# EAGLE design LitBit (EAGLE 9.0.1)
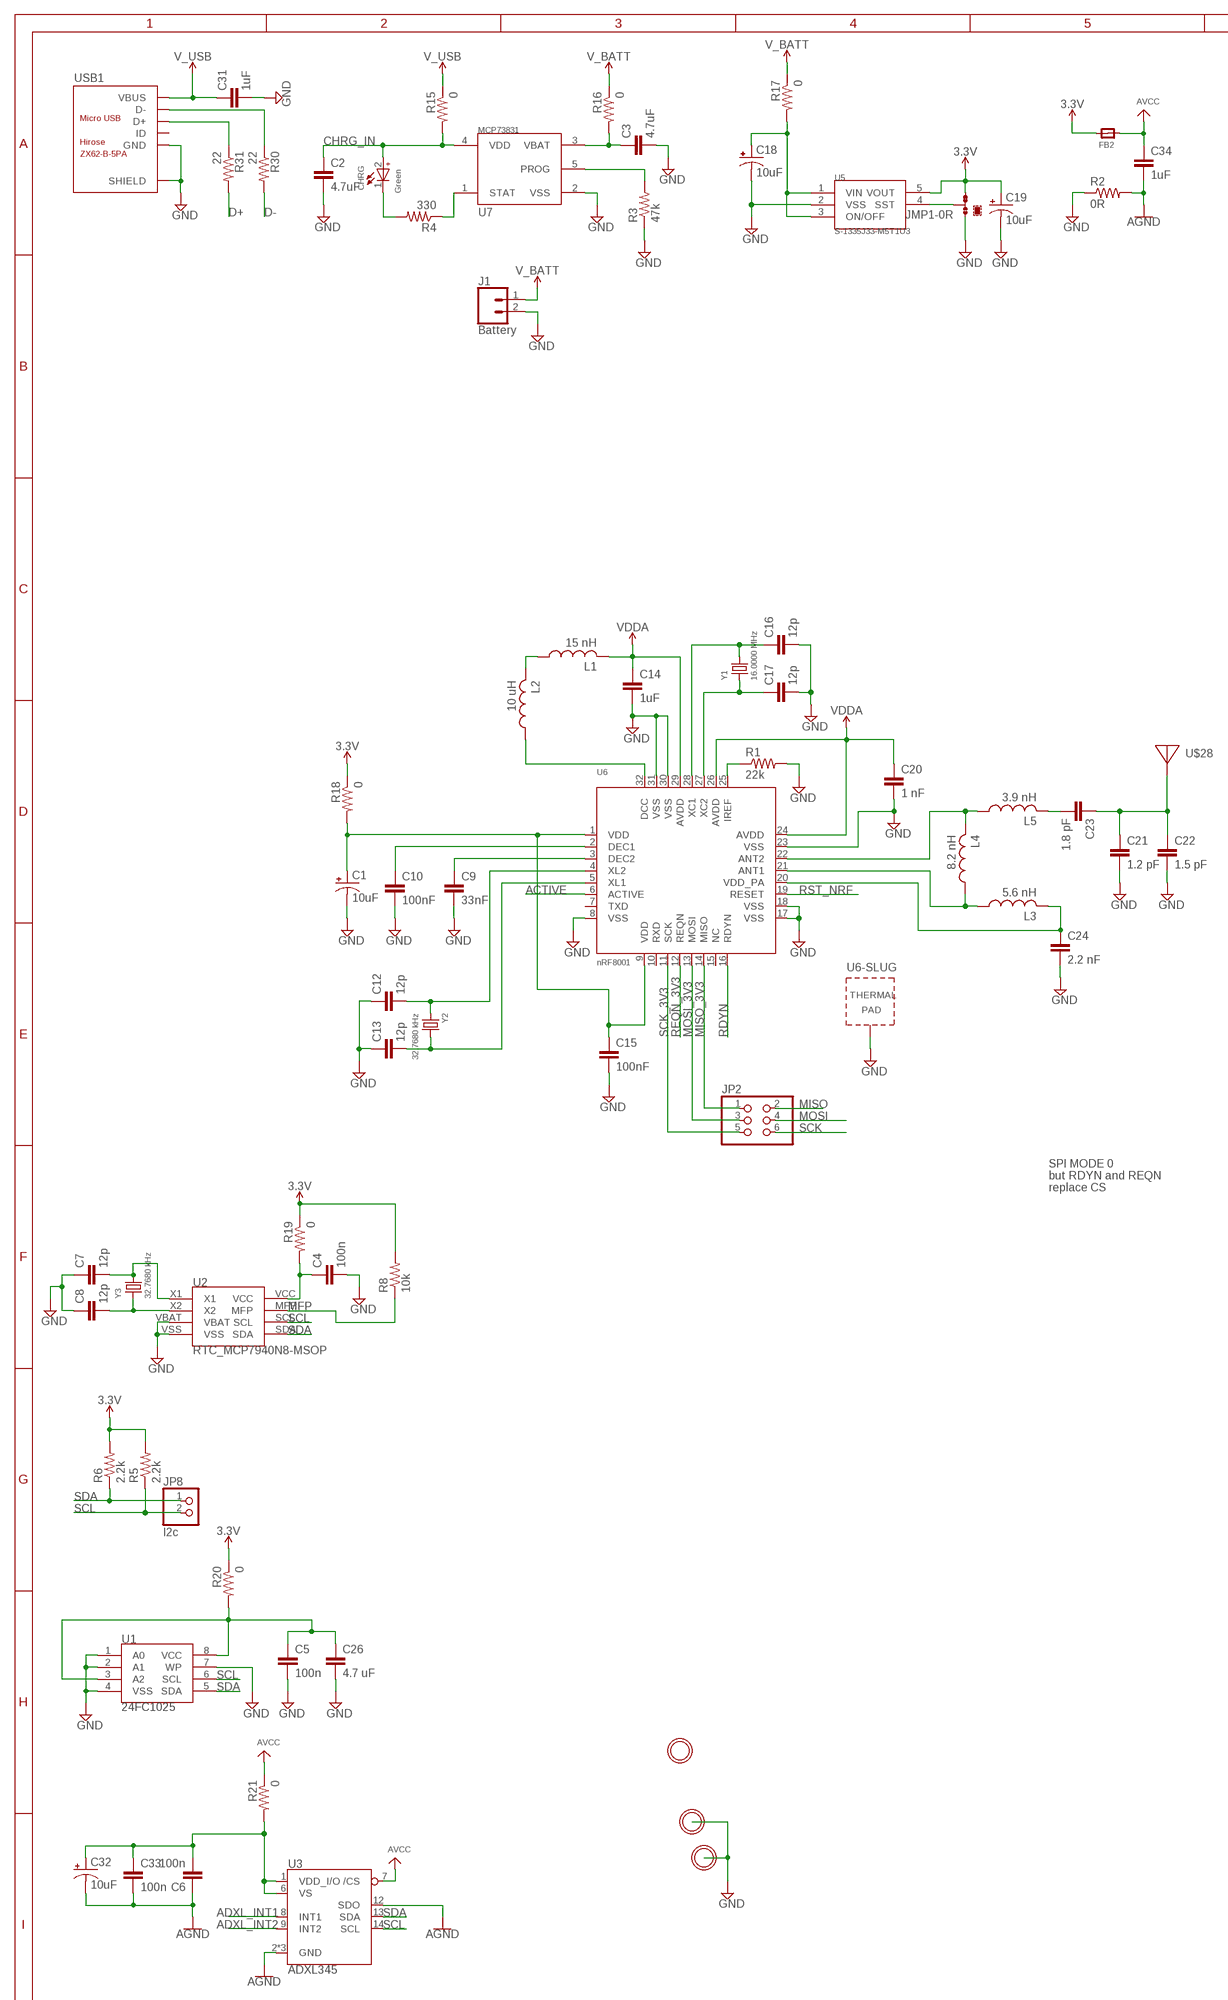
[diagram p0: schematic, sheet 1, part 1 of 2]
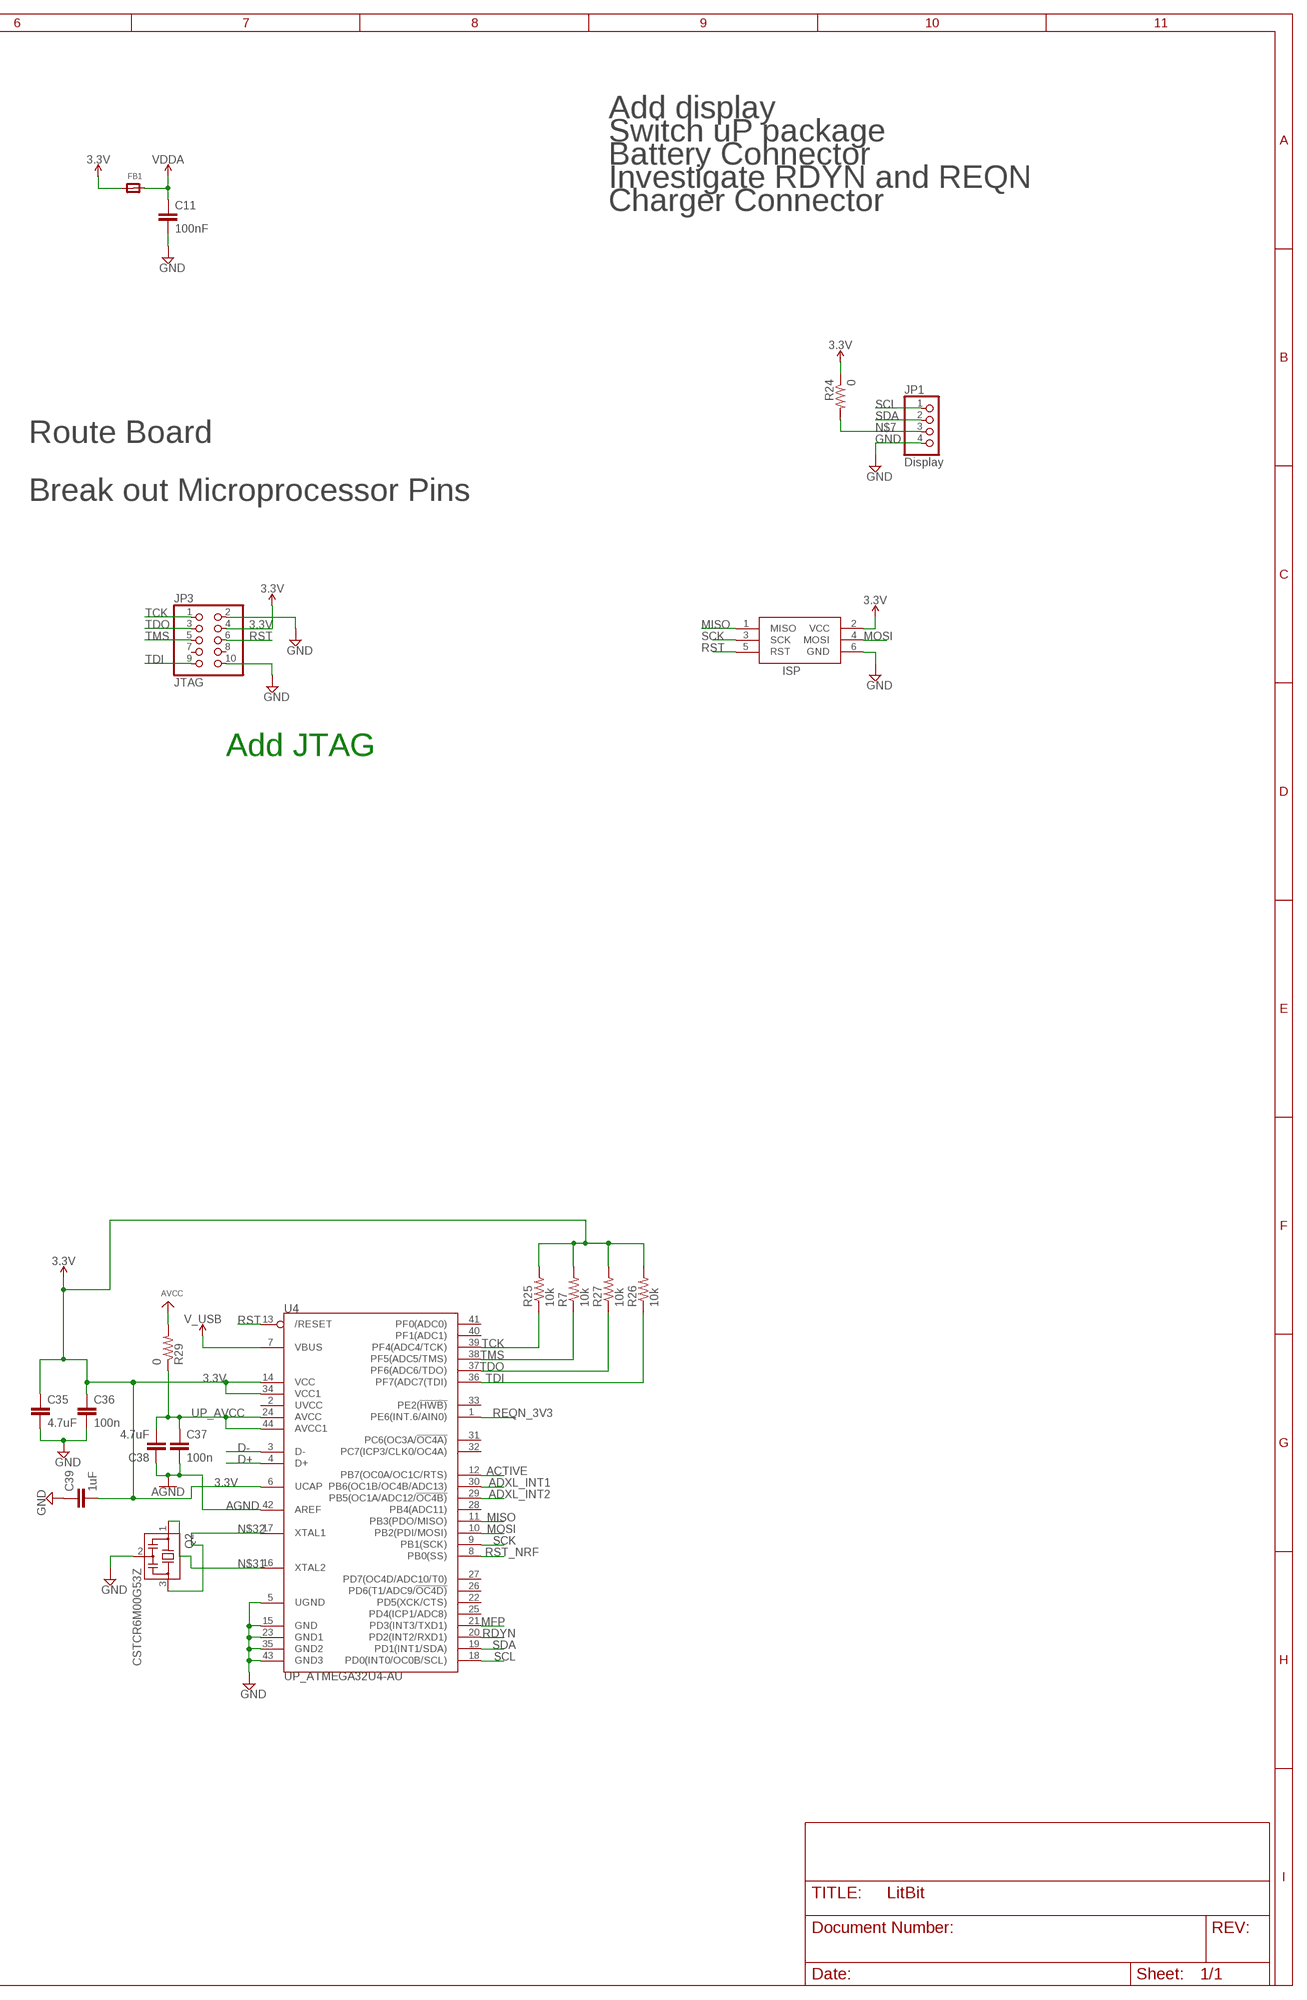
[diagram p1: schematic, sheet 1, part 2 of 2]

## Parts
C1  10uF  CAP_POL_0603  [0603-POLAR]
C2  4.7uF  CAP_NONPOL_0603  [0603-CUSTOM]
C3  4.7uF  CAP_NONPOL_0603  [0603-CUSTOM]
C4  100n  CAP_NONPOL_0603  [0603-CUSTOM]
C5  100n  CAP_NONPOL_0603  [0603-CUSTOM]
C6  100n  CAP_NONPOL_0603  [0603-CUSTOM]
C7  12p  CAP_NONPOL_0603  [0603-CUSTOM]
C8  12p  CAP_NONPOL_0603  [0603-CUSTOM]
C9  33nF  CAP_NONPOL_0603  [0603-CUSTOM]
C10  100nF  CAP_NONPOL_0603  [0603-CUSTOM]
C11  100nF  CAP_NONPOL_0603  [0603-CUSTOM]
C12  12p  CAP_NONPOL_0603  [0603-CUSTOM]
C13  12p  CAP_NONPOL_0603  [0603-CUSTOM]
C14  1uF  CAP_NONPOL_0603  [0603-CUSTOM]
C15  100nF  CAP_NONPOL_0603  [0603-CUSTOM]
C16  12p  CAP_NONPOL_0603  [0603-CUSTOM]
C17  12p  CAP_NONPOL_0603  [0603-CUSTOM]
C18  10uF  CAP_POL_0603  [0603-POLAR]
C19  10uF  CAP_POL_0603  [0603-POLAR]
C20  1 nF  CAP_NONPOL_0603  [0603-CUSTOM]
C21  1.2 pF  CAP_NONPOL_0603  [0603-CUSTOM]
C22  1.5 pF  CAP_NONPOL_0603  [0603-CUSTOM]
C23  1.8 pF  CAP_NONPOL_0603  [0603-CUSTOM]
C24  2.2 nF  CAP_NONPOL_0603  [0603-CUSTOM]
C26  4.7 uF  CAP_NONPOL_0603  [0603-CUSTOM]
C31  1uF  CAP_NONPOL_0603  [0603-CUSTOM]
C32  10uF  CAP_POL_0603  [0603-POLAR]
C33  100n  CAP_NONPOL_0603  [0603-CUSTOM]
C34  1uF  CAP_NONPOL_0603  [0603-CUSTOM]
C35  4.7uF  CAP_NONPOL_0603  [0603-CUSTOM]
C36  100n  CAP_NONPOL_0603  [0603-CUSTOM]
C37  100n  CAP_NONPOL_0603  [0603-CUSTOM]
C38  4.7uF  CAP_NONPOL_0603  [0603-CUSTOM]
C39  1uF  CAP_NONPOL_0603  [0603-CUSTOM]
CHRG  Green  LED_WL-SMCW-150060GS75000  [0603-LED]
FB1  FERRITE  [0603-CUSTOM]
FB2  FERRITE  [0603-CUSTOM]
GND  MOUNTINGHOLE2.0  [MOUNTINGHOLE_2.0_PLATED]
ISP  AVRISP-6  [AVRISP]
J1  Battery  CONN_02-JST-2MM-SMT  [JST-2-SMD]
JMP1  0R-JUMPA  [AOR-JMP-0603]
JP1  Display  PINHD-1X4  [1X04]
JP2  PINHD-2X3  [2X03]
JP3  JTAG  PINHD-2X5  [2X05]
JP8  I2c  PINHD-1X2  [1X02]
L1  15 nH  IND-0603  [0603-CUSTOM]
L2  10 uH  IND-0805  [0805-CUSTOM]
L3  5.6 nH  IND-0603  [0603-CUSTOM]
L4  8.2 nH  IND-0603  [0603-CUSTOM]
L5  3.9 nH  IND-0603  [0603-CUSTOM]
Q2  CSTCR6M00G53Z  [CSTCR6M]
R1  22k  RES-0603  [0603-CUSTOM]
R2  0R  RES-0603  [0603-CUSTOM]
R3  47k  RES-0603  [0603-CUSTOM]
R4  330  RES-0603  [0603-CUSTOM]
R5  2.2k  RES-0603  [0603-CUSTOM]
R6  2.2k  RES-0603  [0603-CUSTOM]
R7  10k  RES-0603  [0603-CUSTOM]
R8  10k  RES-0603  [0603-CUSTOM]
R15  0  RES-0603  [0603-CUSTOM]
R16  0  RES-0603  [0603-CUSTOM]
R17  0  RES-0603  [0603-CUSTOM]
R18  0  RES-0603  [0603-CUSTOM]
R19  0  RES-0603  [0603-CUSTOM]
R20  0  RES-0603  [0603-CUSTOM]
R21  0  RES-0603  [0603-CUSTOM]
R24  0  RES-0603  [0603-CUSTOM]
R25  10k  RES-0603  [0603-CUSTOM]
R26  10k  RES-0603  [0603-CUSTOM]
R27  10k  RES-0603  [0603-CUSTOM]
R29  0  RES-0603  [0603-CUSTOM]
R30  22  RES-0603  [0603-CUSTOM]
R31  22  RES-0603  [0603-CUSTOM]
U1  24FC1025  [8-SOIC_HAND_SOLDER]
U2  RTC_MCP7940N8-MSOP  [8-MSOP-CUSTOM]
U3  ADXL345  [LGA-14]
U4  UP_ATMEGA32U4-AU  [TQFP44]
U5  S-1335J33-M5T1U3  [SOT23-5_HAND_SOLDER]
U6  nRF8001  NRF8001  [QFN32_5MM]
U7  MCP73831  [SOT23-5_HAND_SOLDER]
U$8  MOUNTINGHOLE2.0  [MOUNTINGHOLE_2.0_PLATED]
U$13  MOUNTINGHOLE2.0  [MOUNTINGHOLE_2.0_PLATED]
U$28  ANTENNA_PCBNRF8001_1.6MM  [ANT_PCB_2.4GHZ_NRF8001_1.6MM_1OZ]
USB1  ZX62-B-5PA  MICRO-USB-SMD(ZX62-B-5PA)  [MICRO-USB5+6P-SMD-0.65-AB]
Y1  16.0000 MHz  FA-238_CRYSTAL  [4-SMD]
Y2  32.7680 kHz  CRYSTAL_ABS07  [2-SMD]
Y3  32.7680 kHz  CRYSTAL_ABS07  [2-SMD]

## Nets
3.3V: C19.1(+) C35.1 C36.1 C39.2 FB1.1 FB2.2 ISP.2(VCC) JMP1.3 JP3.4 R5.2 R6.2 R7.2 R8.2 R18.1 R19.1 R20.1 R24.1 R25.2 R26.2 R27.2 U4.6(UCAP) U4.14(VCC) U4.34(VCC1) U5.5(VOUT)
ACTIVE: U4.12(PB7(OC0A/OC1C/RTS)) U6.6(ACTIVE)
ADXL_INT1: U3.8(INT1) U4.30(PB6(OC1B/OC4B/ADC13))
ADXL_INT2: U3.9(INT2) U4.29(PB5(OC1A/ADC12/!OC4B))
AGND: C6.1 C32.2(-) C33.2 C34.2 C37.2 C38.1 R2.2 U3.2(GND) U3.4(GND) U3.5(GND) U3.12(SDO) U4.42(AREF)
AVCC: C34.1 FB2.1 R21.1 R29.2 U3.7(/CS)
CHRG_IN: C2.1 CHRG.2(+) R15.2 U7.4(VDD)
D+: R31.2 U4.4(D+)
D-: R30.2 U4.3(D-)
GND: C1.2(-) C2.2 C3.2 C4.2 C5.2 C7.1 C8.1 C9.2 C10.2 C11.2 C12.1 C13.1 C14.2 C15.2 C16.2 C17.2 C18.2(-) C19.2(-) C20.2 C21.2 C22.2 C24.2 C26.2 C31.2 C35.2 C36.2 C39.1 ISP.6(GND) J1.2 JMP1.1 JP1.4 JP3.2 JP3.10 Q2.2 R1.2 R2.1 R3.1 U1.1(A0) U1.2(A1) U1.4(VSS) U1.7(WP) U2.VBAT U2.VSS U4.5(UGND) U4.15(GND) U4.23(GND1) U4.35(GND2) U4.43(GND3) U5.2(VSS) U6.8(VSS) U6.17(VSS) U6.18(VSS) U6.23(VSS) U6.30(VSS) U6.31(VSS) U6.33(TP) U7.2(VSS) USB1.5(GND) USB1.P1(SHIELD) USB1.P2(SHIELD) USB1.P3(SHIELD) USB1.P4(SHIELD) USB1.P5(SHIELD) USB1.P6(SHIELD)
MFP: R8.1 U2.MFP U4.21(PD3(INT3/TXD1))
MISO: ISP.1(MISO) JP2.2 U4.11(PB3(PDO/MISO))
MISO_3V3: JP2.1 U6.14(MISO)
MOSI: ISP.4(MOSI) JP2.4 U4.10(PB2(PDI/MOSI))
MOSI_3V3: JP2.3 U6.13(MOSI)
N$1: C7.2 U2.X1 Y3.P$2
N$2: C8.2 U2.X2 Y3.P$1
N$3: C10.1 U6.2(DEC1)
N$4: C9.1 U6.3(DEC2)
N$5: C12.2 U6.4(XL2) Y2.P$1
N$6: C13.2 U6.5(XL1) Y2.P$2
N$7 [PWR]: JP1.3 R24.2
N$8: C1.1(+) C15.1 R18.2 U6.1(VDD) U6.9(VDD)
N$9: R30.1 USB1.2(D-)
N$10: L1.1 L2.2
N$11: L2.1 U6.32(DCC)
N$12: C16.1 U6.28(XC1) Y1.P3
N$13: JMP1.2 U5.4(SST)
N$14: C18.1(+) R17.2 U5.1(VIN) U5.3(ON/OFF)
N$16 [PWR]: C3.1 R16.2 U7.3(VBAT)
N$17: C5.1 C26.1 R20.2 U1.3(A2) U1.8(VCC)
N$18: C17.1 U6.27(XC2) Y1.P1
N$19: C23.2 L5.2
N$20: L4.2 L5.1 U6.22(ANT2)
N$21: L3.1 L4.1 U6.21(ANT1)
N$22: R1.1 U6.25(IREF)
N$23: C24.1 L3.2 U6.20(VDD_PA)
N$24: C21.1 C22.1 C23.1 U$28.FEED
N$25: CHRG.1(-) R4.2
N$26: R3.2 U7.5(PROG)
N$27: R4.1 U7.1(STAT)
N$28: R31.1 USB1.3(D+)
N$29: C4.1 R19.2 U2.VCC
N$31: Q2.1 U4.16(XTAL2)
N$32: Q2.3 U4.17(XTAL1)
N$36: C6.2 C32.1(+) C33.1 R21.2 U3.1(VDD_I/O) U3.6(VS)
RDYN: U4.20(PD2(INT2/RXD1)) U6.16(RDYN)
REQN_3V3: U4.1(PE6(INT.6/AIN0)) U6.12(REQN)
RST: ISP.5(RST) JP3.6 U4.13(/RESET)
RST_NRF: U4.8(PB0(SS)) U6.19(RESET)
SCK: ISP.3(SCK) JP2.6 U4.9(PB1(SCK))
SCK_3V3: JP2.5 U6.11(SCK)
SCL: JP1.1 JP8.2 R5.1 U1.6(SCL) U2.SCL U3.14(SCL) U4.18(PD0(INT0/OC0B/SCL))
SDA: JP1.2 JP8.1 R6.1 U1.5(SDA) U2.SDA U3.13(SDA) U4.19(PD1(INT1/SDA))
TCK: JP3.1 R25.1 U4.39(PF4(ADC4/TCK))
TDI: JP3.9 R26.1 U4.36(PF7(ADC7(TDI))
TDO: JP3.3 R27.1 U4.37(PF6(ADC6/TDO))
TMS: JP3.5 R7.1 U4.38(PF5(ADC5/TMS))
UP_AVCC: C37.1 C38.2 R29.1 U4.24(AVCC) U4.44(AVCC1)
V_BATT [PWR]: J1.1 R16.1 R17.1
V_USB: C31.1 R15.1 U4.7(VBUS) USB1.1(VBUS)
VDDA: C11.1 C14.1 C20.1 FB1.2 L1.2 U6.24(AVDD) U6.26(AVDD) U6.29(AVDD)
Unconnected: JP3.7 JP3.8 U4.2(UVCC) U4.22(PD5(XCK/CTS)) U4.25(PD4(ICP1/ADC8)) U4.26(PD6(T1/ADC9/!OC4D)) U4.27(PD7(OC4D/ADC10/T0)) U4.28(PB4(ADC11)) U4.31(PC6(OC3A/!OC4A)) U4.32(PC7(ICP3/CLK0/OC4A)) U4.33(PE2(!HWB)) U4.40(PF1(ADC1)) U4.41(PF0(ADC0)) U6.7(TXD) U6.10(RXD) U6.15(NC) USB1.4(ID)

## Notes on the sheet
- Add display
- Switch uP package
- Battery Connector
- Investigate RDYN and REQN
- Charger Connector
- Route Board
- Break out Microprocessor Pins
- Add JTAG
- SPI MODE 0
- but RDYN and REQN
- replace CS

## Library data of the parts
C1 C18 C19 C32 = SCADA_CUSTOM_LIBRARY:CAP_POL_0603
C2-C17 C20-C24 C26 C31 C33-C39 = SCADA_CUSTOM_LIBRARY:CAP_NONPOL_0603
CHRG = SCADA_CUSTOM_LIBRARY:LED_WL-SMCW: SMD mono-color Chip LED Characteristics Low energy consumption High reliability Low current requirement Fast switching No UV/IR radiation Smallest SMD package with exceptional brightness Top view Wide viewing angle PBC high-usage Applications Backlight for mobile and portable device keypads Indoor and outdoor message boards Flat backlight for LCDs, switches and symbols Display for industrial control systems and traffic Miniaturized color effects Pedestrian mark Optical indicators General lighting Toys <http://katalog.we-online.de/media/images/v2/Family_WL-SMCW.jpg> Details see: http://katalog.we-online.de/en/led/WL-SMCW?m Updated 2015-04-10 2015 (C) Wurth Elektronik
FB1 FB2 = SCADA_CUSTOM_LIBRARY:FERRITE: Ferrite Bead 0603 MMZ1608B121C - 120 Ohm @ 100MHz, 600mA, 0.15 Ohm DC Resistance - Digikey: 445-2164-1-ND BK1608HW121-T - 120 Ohm, 600mA Ferrite Chip - Digikey: 587-1876-2-ND 0805 HZ0805B272R-10 - 2.7K Ohm @ 100MHz, 200mA, 0.8 Ohm DC Resistance - Digikey: 240-2504-1-ND (see also Murata BLM21BD272SN1L) MMZ2012Y152B - 1.5K Ohm @ 100MHz, 500mA, 0.4 Ohm DC Resistance - Digikey: 445-1560-1-ND - Mainly for high frequency (80-400MHz) MMZ2012R102A - 1K Ohm @ 100MHz, 500mA, 0.3 Ohm DC Resistance - Digikey: 445-1555-2-ND - More general purpose (10-200MHz)
GND U$8 U$13 = microbuilder:MOUNTINGHOLE: Mounting Hole For #2 screws (0.086"/2.18mm width, 0.094"/2.4mm hole) use 2.5mm
ISP = adafruit:AVRISP: AVR ISP HEADER Standard 6 pin header for AVR programming
J1 = SparkFun-Connectors:CONN_02: Multi connection point. Often used as Generic Header-pin footprint for 0.1 inch spaced/style header connections On any of the 0.1 inch spaced packages, you can populate with these: Break Away Headers - Straight <https://www.sparkfun.com/products/116> (PRT-00116) Break Away Male Headers - Right Angle <https://www.sparkfun.com/products/553> (PRT-00553) Female Headers <https://www.sparkfun.com/products/115> (PRT-00115) Break Away Headers - Machine Pin <https://www.sparkfun.com/products/117> (PRT-00117) Break Away Female Headers - Swiss Machine Pin <https://www.sparkfun.com/products/743> (PRT-00743) For SCREWTERMINALS and SPRING TERMINALS visit here: Screw Terimnals on SparkFun.com <https://www.sparkfun.com/search/results?term=Screw+Terminals> (5mm/3.5mm/2.54mm spacing) This device is also useful as a general connection point to wire up your design to another part of your project. Our various solder wires solder well into these plated through hole pads. Hook-Up Wire - Assortment (Stranded, 22 AWG) <https://www.sparkfun.com/products/11375> (PRT-11375) Hook-Up Wire - Assortment (Solid Core, 22 AWG) <https://www.sparkfun.com/products/11367> (PRT-11367) View the entire wire category on our website here <https://www.sparkfun.com/categories/141> Special notes: Molex polarized connector foot print use with: PRT-08233 with associated crimp pins and housings. 2.54_SCREWTERM for use with PRT-10571. 3.5mm Screw Terminal footprints for PRT-08084 5mm Screw Terminal footprints for use with PRT-08432; PROD_ID: CONN-11443
JMP1 = SCADA_CUSTOM_LIBRARY:0R-JUMP: SMD 0R 0805 Jumper
JP1 = pinhead:PINHD-1X4: PIN HEADER
JP2 = pinhead:PINHD-2X3: PIN HEADER
JP3 = pinhead:PINHD-2X5: PIN HEADER
JP8 = pinhead:PINHD-1X2: PIN HEADER
L1 L3-L5 = SCADA_CUSTOM_LIBRARY:IND-0603
L2 = SCADA_CUSTOM_LIBRARY:IND-0805
Q2 = murata-filter:CSTCR: Resonator Source: murata.co.jp; MPN: CSTCR6M00G53-R0; OC_FARNELL: 1170434; OC_NEWARK: 25M8759
R1-R8 R15-R21 R24-R27 R29-R31 = SCADA_CUSTOM_LIBRARY:RES-0603
U1 = SCADA_CUSTOM_LIBRARY:24FC1025
U2 = SCADA_CUSTOM_LIBRARY:RTC_MCP7940N
U3 = SCADA_CUSTOM_LIBRARY:ADXL345: Analog Devices ADXL345 3-Axis SPI/I2C 2/4/8/16g Accelerometer The ADXL345 is a small, thin, low power, 3-axis accelerometer with high resolution (13-bit) measurement at up to ±16g. Digital output data is formatted as 16-bit twos complement and is accessible through either a SPI (3- or 4-wire) or I2C digital interface. Datasheet <https://www.sparkfun.com/datasheets/Sensors/Accelerometer/ADXL345.pdf> SparkFun Products SparkFun Triple Axis Accelerometer Breakout - ADXL345 <https://www.sparkfun.com/products/9836> (SEN-09836) Triple Axis Accelerometer - ADXL345 <https://www.sparkfun.com/products/9045> (SEN-09045) SparkFun 6 Degrees of Freedom IMU Digital Combo Board - ITG3200/ADXL345 <https://www.sparkfun.com/products/10121> (SEN-10121); PROD_ID: IC-09097; SF_ID: SEN-09045
U4 = SCADA_CUSTOM_LIBRARY:UP_ATMEGA32U4: http://www.ladyada.net/library/eagle
U5 = SCADA_CUSTOM_LIBRARY:S-1335J33-M5T1U3
U6 = microbuilder:NRF8001: nRF8001 - Bluetooth Low-Energy Transceiver VDD: 1.9-3.6V Temp: -40°C - 85°C
U7 = SCADA_CUSTOM_LIBRARY:MCP73831: MCP73831/2 Miniature Single-Cell, Fully Integrated Li-Ion, Li-Polymer Charge Management Controllers. Nice and small simple lipoly charge controller, with adjustable current and status output (LED) http://www.ladyada.net/library/pcb/eaglelibrary.html
U$28 = microbuilder:ANTENNA_PCB: Various pre-calculated PCB Antennas NRF8001 1.6mm 1Oz - 2.4GHz PCB antenna for 1.6mm PCBs with 1oz copper, double-sided boards (no GND plan beneath antenna). See nRF2740 production files for further information and impedance matching network. 868MHz/2.4GHz DUALBAND - Dual 868MHz and 2.4GHz centered antenna based on board #6 of the CC-ANTENNA-DK from Chipcon/TI
USB1 = Seeed-Connector:MICRO-USB-SMD(ZX62-B-5PA): 320010005; MPN: ZX62-B-5PA
Y1 = SCADA_CUSTOM_LIBRARY:FA-238_CRYSTAL
Y2 Y3 = SCADA_CUSTOM_LIBRARY:CRYSTAL_ABS07

## Net classes
0 Default: width 0.203 mm
1 PWR: width 0.508 mm
2 V_BATT: width 0.508 mm

## Board
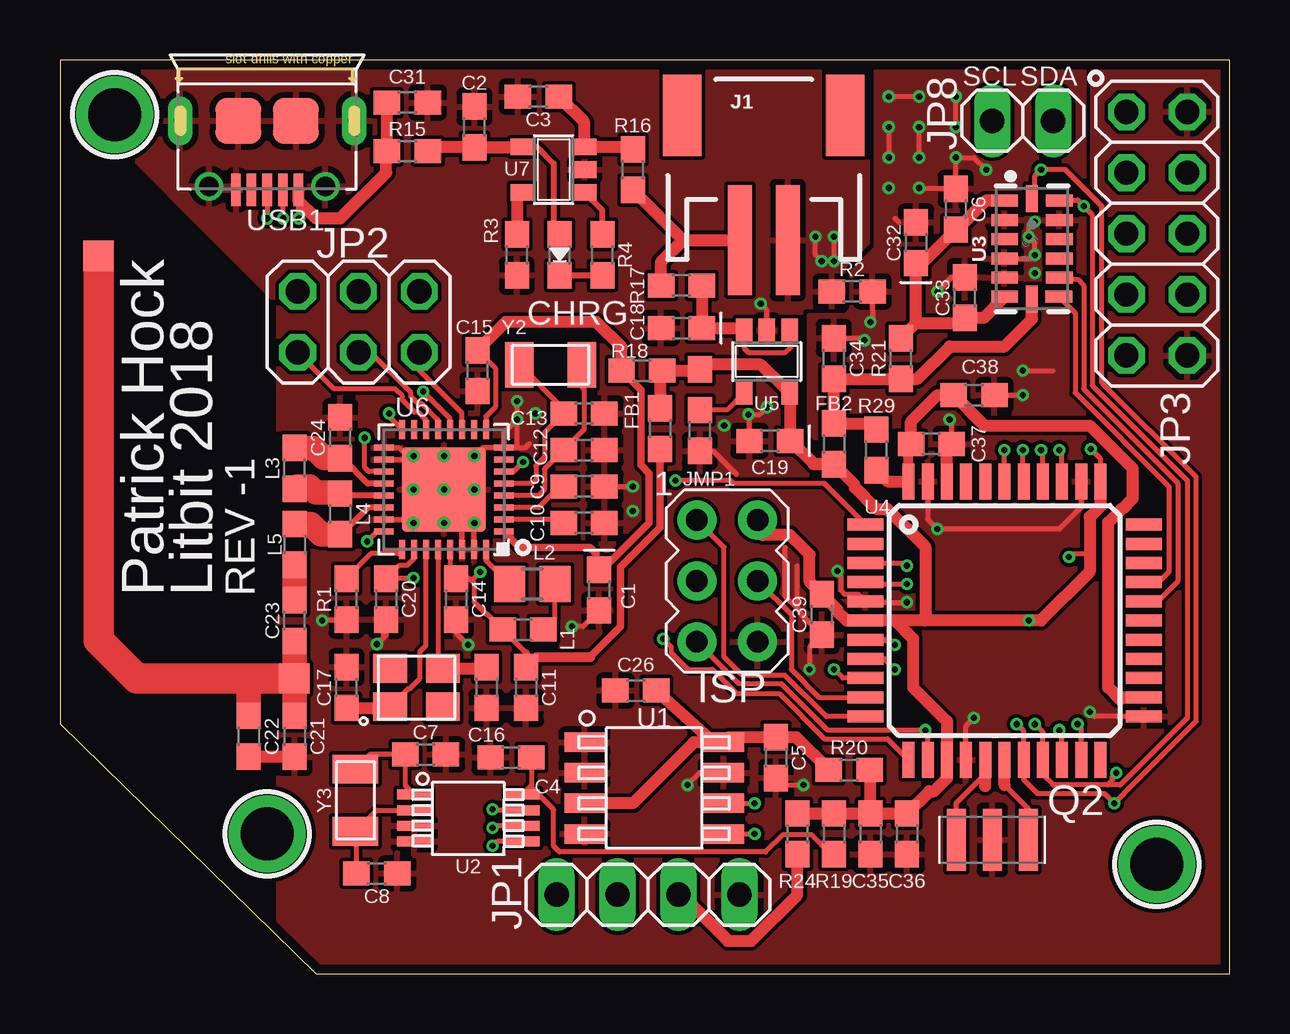
[diagram p2: board, top side]
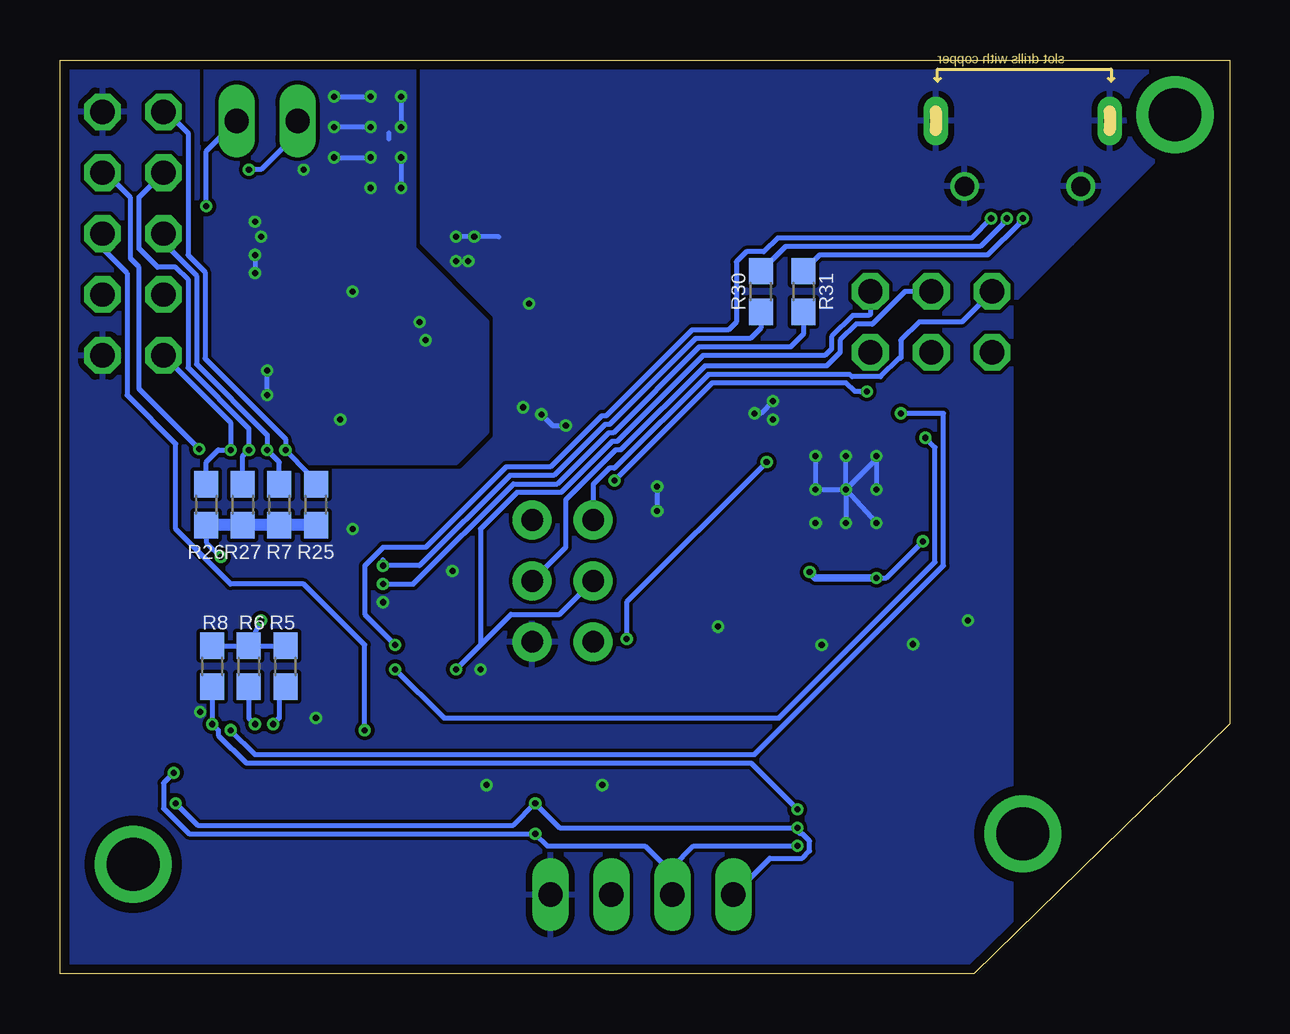
[diagram p3: board, bottom side, seen from below]

Size 48.77 x 38.1 mm. Coordinates in mm from the lower left corner, seen from the top.
Outline: 48.77,0 48.77,38.1 0,38.1 0,10.41 10.67,0 48.77,0
Copper layers (1*16): Top 0.035559375mm / dielectric 1.6mm / Bottom 0.035559375mm
Design rules "oshpark-2layer": minimum track width 6mil, minimum drill 10mil, track to track 6mil, track to pad 6mil, pad to pad 6mil, via to via 6mil, smd to smd 6mil, copper to edge 15mil, drill to drill 6mil, minimum pad ring 5mil, minimum via ring 5mil, stop-mask expansion 2.5mil, vias tented up to drill 0mil, thermal gap 10mil

### Footprints (pad centres in the part's own frame; a part is rotated, then mirrored left to right if it is on the bottom)
0603-POLAR = smd 1.1 x 1: 1 -0.85,0; 2 0.85,0
0603-CUSTOM = smd 1.1 x 1: 1 -0.85,0; 2 0.85,0
0603-LED = smd 1.1 x 1: 1 -0.85,0; 2 0.85,0
MOUNTINGHOLE_2.0_PLATED = drill 2.2 pad 3: P$1 0,0
AVRISP = drill 0.9 pad 1.626: 1 -1.27,2.54; 2 1.27,2.54; 3 -1.27,0; 4 1.27,0; 5 -1.27,-2.54; 6 1.27,-2.54
JST-2-SMD = smd 1 x 4.6: 1 -1,-3.7; 2 1,-3.7 | smd 1.6 x 3.4: NC1 -3.4,1.5; NC2 3.4,1.5
AOR-JMP-0603 = smd 1.1 x 1: 1 -1.688,0; 2 0.012,0; 3 1.714,0
1X04 = drill 1.016 long: 1 -3.81,0; 2 -1.27,0; 3 1.27,0; 4 3.81,0
2X03 = drill 1.016 octagon: 1 -2.54,-1.27; 2 -2.54,1.27; 3 0,-1.27; 4 0,1.27; 5 2.54,-1.27; 6 2.54,1.27
2X05 = drill 1.016 octagon: 1 -5.08,-1.27; 2 -5.08,1.27; 3 -2.54,-1.27; 4 -2.54,1.27; 5 0,-1.27; 6 0,1.27; 7 2.54,-1.27; 8 2.54,1.27; 9 5.08,-1.27; 10 5.08,1.27
1X02 = drill 1.016 long: 1 -1.27,0; 2 1.27,0
0805-CUSTOM = smd 1.3 x 1.5: 1 -0.95,0; 2 0.95,0
CSTCR6M = smd 0.8 x 2.6: 1 -1.5,0; 2 0,0; 3 1.5,0
8-SOIC_HAND_SOLDER = smd 1.676 x 0.813: 1 -2.9,1.91; 2 -2.9,0.64; 3 -2.9,-0.63; 4 -2.9,-1.91; 5 2.9,-1.91; 6 2.9,-0.63; 7 2.9,0.64; 8 2.9,1.91
8-MSOP-CUSTOM = smd 1.45 x 0.42: MFP 2.25,0.35; SCL 2.25,-0.3; SDA 2.25,-0.95; VBAT -2.25,-0.3; VCC 2.25,1; VSS -2.25,-0.95; X1 -2.25,1; X2 -2.25,0.35
LGA-14 = smd 0.5 x 1.124: 1 2,1.138; 2 1.2,1.138; 3 0.4,1.138; 4 -0.4,1.138; 5 -1.2,1.138; 6 -2,1.138; 8 -2,-1.13; 9 -1.2,-1.138; 10 -0.4,-1.138; 11 0.4,-1.138; 12 1.2,-1.138; 13 2,-1.138 | smd 1.124 x 0.5: 7 -2.1,0; 14 2.1,0
TQFP44 = smd 1.5 x 0.5: 1 -5.8,4; 2 -5.8,3.2; 3 -5.8,2.4; 4 -5.8,1.6; 5 -5.8,0.8; 6 -5.8,0; 7 -5.8,-0.8; 8 -5.8,-1.6; 9 -5.8,-2.4; 10 -5.8,-3.2; 11 -5.8,-4; 23 5.8,-4; 24 5.8,-3.2; 25 5.8,-2.4; 26 5.8,-1.6; 27 5.8,-0.8; 28 5.8,0; 29 5.8,0.8; 30 5.8,1.6; 31 5.8,2.4; 32 5.8,3.2; 33 5.8,4 | smd 0.5 x 1.5: 12 -4,-5.8; 13 -3.2,-5.8; 14 -2.4,-5.8; 15 -1.6,-5.8; 16 -0.8,-5.8; 17 0,-5.8; 18 0.8,-5.8; 19 1.6,-5.8; 20 2.4,-5.8; 21 3.2,-5.8; 22 4,-5.8; 34 4,5.8; 35 3.2,5.8; 36 2.4,5.8; 37 1.6,5.8; 38 0.8,5.8; 39 0,5.8; 40 -0.8,5.8; 41 -1.6,5.8; 42 -2.4,5.8; 43 -3.2,5.8; 44 -4,5.8
SOT23-5_HAND_SOLDER = smd 0.69 x 0.99: 1 -0.95,-1.29; 2 0,-1.29; 3 0.95,-1.29; 4 0.95,1.3; 5 -0.95,1.3
QFN32_5MM = smd 0.8 x 0.25: 1 -2.5,1.75; 2 -2.5,1.25; 3 -2.5,0.75; 4 -2.5,0.25; 5 -2.5,-0.25; 6 -2.5,-0.75; 7 -2.5,-1.25; 8 -2.5,-1.75; 17 2.5,-1.75; 18 2.5,-1.25; 19 2.5,-0.75; 20 2.5,-0.25; 21 2.5,0.25; 22 2.5,0.75; 23 2.5,1.25; 24 2.5,1.75 | smd 0.25 x 0.8: 9 -1.75,-2.5; 10 -1.25,-2.5; 11 -0.75,-2.5; 12 -0.25,-2.5; 13 0.25,-2.5; 14 0.75,-2.5; 15 1.25,-2.5; 16 1.75,-2.5; 25 1.75,2.5; 26 1.25,2.5; 27 0.75,2.5; 28 0.25,2.5; 29 -0.25,2.5; 30 -0.75,2.5; 31 -1.25,2.5; 32 -1.75,2.5 | smd 3.5 x 3.5: 33 0,0
ANT_PCB_2.4GHZ_NRF8001_1.6MM_1OZ = smd 1.27 x 1.27: FEED 0,0; TESTPOINT -8.169,17.605
MICRO-USB5+6P-SMD-0.65-AB = smd 0.4 x 1.35: 1 -1.3,2.875; 2 -0.65,2.875; 3 0,2.875; 4 0.65,2.875; 5 1.3,2.875 | smd 1.9 x 1.9: P1 -1.2,0; P2 1.2,0 | drill 0.508 pad 1.016 long: P3 -3.625,0; P4 3.625,0 | drill 0.8: P5 -2.425,2.73; P6 2.425,2.73
4-SMD = smd 1.4 x 1.2: P1 -1.1,-0.8; P2 1.1,-0.8; P3 1.1,0.8; P4 -1.1,0.8
2-SMD = smd 1.2 x 1.9: P$1 -1.3,0; P$2 1.3,0

### Placement (x,y rotation side)
C1  22.48,16 270 top
C2  17.27,35.31 90 top
C3  19.94,36.58 180 top
C4  18.8,9.02 180 top
C5  29.84,9.02 270 top
C6  37.34,31.88 270 top
C7  15.24,9.14 180 top
C8  13.21,4.19 180 top
C9  21.84,20.32 0 top
C10  21.84,18.8 0 top
C11  19.43,11.94 270 top
C12  21.84,21.84 180 top
C13  21.84,23.37 180 top
C14  16.51,15.62 270 top
C15  17.4,25.15 270 top
C16  17.78,11.94 270 top
C17  11.94,11.94 90 top
C18  25.91,26.92 180 top
C19  29.59,22.23 180 top
C20  13.59,15.62 270 top
C21  9.78,9.91 270 top
C22  7.87,9.91 270 top
C23  9.78,14.73 90 top
C24  11.68,22.35 90 top
C26  24,11.81 180 top
C31  14.48,36.32 0 top
C32  35.69,30.48 90 top
C33  37.72,28.19 90 top
C34  32.26,25.65 90 top
C35  33.78,5.84 270 top
C36  35.31,5.84 270 top
C37  36.32,22.1 0 top
C38  38.1,24.13 180 top
C39  31.75,14.99 90 top
CHRG  20.83,29.97 90 top
FB1  25.02,22.73 270 top
FB2  32.26,22.1 270 top
GND  45.72,4.57 0 top
ISP  27.81,16.38 0 top
J1  29.34,34.29 0 top
JMP1  26.67,23.5 90 top
JP1  24.51,3.3 0 top
JP2  12.45,27.18 0 top
JP3  45.72,30.86 270 top
JP8  40.13,35.56 180 top
L1  19.3,14.35 180 top
L2  19.68,16.26 0 top
L3  9.78,21.08 90 top
L4  11.68,19.18 270 top
L5  9.78,17.91 270 top
Q2  38.86,5.59 0 top
R1  11.94,15.62 270 top
R2  33.02,28.45 0 top
R3  19.05,29.97 90 top
R4  22.61,29.97 270 top
R5  39.37,12.83 90 bottom
R6  40.89,12.83 90 bottom
R7  39.62,19.56 270 bottom
R8  42.42,12.83 90 bottom
R15  14.48,34.29 0 top
R16  23.88,33.53 90 top
R17  25.91,28.7 0 top
R18  24.26,25.15 180 top
R19  32.26,5.84 270 top
R20  32.89,8.51 180 top
R21  35.05,25.65 90 top
R24  30.73,5.84 270 top
R25  38.1,19.56 270 bottom
R26  42.67,19.56 270 bottom
R27  41.15,19.56 270 bottom
R29  34.04,21.84 90 top
R30  19.56,28.45 270 bottom
R31  17.78,28.45 270 bottom
U1  24.77,7.75 0 top
U2  17.02,6.48 0 top
U3  40.51,30.23 90 top
U4  39.37,14.73 0 top
U5  29.46,25.53 180 top
U6  16,20.19 180 top
U7  20.57,33.53 90 top
U$8  8.64,5.84 0 top
U$13  2.29,35.81 0 top
U$28  9.78,12.32 0 top
USB1  8.64,35.56 180 top
Y1  14.86,11.94 0 top
Y2  20.45,25.4 180 top
Y3  12.32,7.24 90 top

### Tracks (layer width: path | path; a pad name or v marks a point on that pad's centre or on a via)
3.3V  (via drill 0.25)
  Top 0.203: 34.29,14.73 33.78,14.73 | v42.97,21.89 43.37,21.48 U4.34 | v42.06,17.38 42.21,17.53 42.93,17.53
  Top 0.508: FB2.2 31.42,21.25 C19.1 30.44,24.2 U5.5 29.75,24.89 29.72,24.89 29.21,25.4 26.86,25.4 JMP1.3 26.61,25.15 R18.1 25.02,25.06 FB1.1 | U4.34 43.37,19.49 42.93,19.05 42.93,17.53 42.93,16.76 40.89,14.73 v40.39,14.73 36.07,14.73 | 36.07,14.73 34.8,14.73 | 34.8,14.73 33.78,14.73 U4.6 32.8,14.73 32.41,15.11 32.41,15.17 C39.2 31.24,16.34 31.24,17.48 30.44,18.29 29.3,18.29 29.08,18.5 ISP.2 | 34.8,14.73 35.56,13.97 35.56,11.94 36.97,10.53 U4.14 36.97,8.16 36.43,7.62 36.23,7.62 C36.1 C35.1 | C35.1 33.78,8.47 R20.1 | R24.1 R19.1 C35.1 | 31.41,21.25 FB2.2 | FB2.2 33.13,20.38 33.13,20.28 34.02,19.39 34.49,19.39 36.07,17.81 36.07,14.73
  Bottom 0.203: R6.2 v40.39,14.73 | R8.2 R6.2 | R6.2 R5.2 | JP3.4 46.86,33.4 45.82,32.36 45.82,29.82 45.47,29.46 45.47,24.38 v42.97,21.89 | R26.2 42.67,17.99 v42.06,17.38
  Bottom 0.508: R25.2 R7.2 R27.2 R26.2
ACTIVE  (via drill 0.25)
  Top 0.203: v25.15,13.97 25.48,13.64 25.48,13.4 26.18,12.7 27.19,12.7 28.2,11.68 29.98,11.68 31.86,9.8 34.5,9.8 U4.12 | U6.6 18.91,20.94 v19.31,21.34
  Bottom 0.203: v19.31,21.34 25.15,15.5 v25.15,13.97
ADXL_INT1
  Top 0.203: U3.8 42.32,27.55 42.32,24.23 46.23,20.32 46.23,16.76 45.72,16.26 45.25,16.26 U4.30
ADXL_INT2
  Top 0.203: U3.9 41.72,28.96 42.42,28.96 42.67,28.7 42.67,24.38 46.58,20.47 46.58,16.36 45.76,15.53 U4.29
AGND  (via drill 0.25)
  Top 0.203: U3.4 40.49,29.83 v40.64,29.97 40.64,30.48 v40.39,30.73 40.39,31.1 v40.64,31.36 | C34.2 33.44,26.5 v33.53,26.42 | C37.2 37.17,23.03 v37.08,23.11 | C38.1 v40.13,24.13 | v40.13,25.15 41.4,25.15 | v35.81,32.77 35.85,32.73 C6.1 v37.34,34.04 38.1,34.04 v38.61,33.53 | C33.2 37.17,29.04 v36.58,28.45 | R2.2 33.87,27.27 v33.78,27.18 | 34.96,31.33 34.8,31.5 | v35.81,34.04 v35.81,35.31 | v37.34,35.31 v37.34,36.58 37.34,36.83 | v35.81,36.58 v34.54,36.58 | v34.54,35.31 v34.54,34.04
  Top 0.508: U4.42 36.97,21.9 C37.2
  Bottom 0.203: v40.13,24.13 v40.13,25.15 | v40.64,29.97 v40.64,29.21 | v37.34,34.04 v35.81,34.04 | 35.05,34.8 35.05,35.05 | v35.81,35.31 v37.34,35.31 | v37.34,36.58 v35.81,36.58 | v34.54,36.58 v34.54,35.31 | v34.54,34.04 v34.54,32.77
  pour Top: 34.04,38.1 34.04,30.23 33.02,29.21 33.02,27.69 32.77,27.43 31.24,27.43 31.24,22.61 31.75,22.1 37.08,22.1 38.35,20.83 42.16,20.83 42.67,21.08 42.67,38.1
  pour Bottom: 42.67,38.1 42.67,22.1 41.91,21.34 32.26,21.34 30.99,22.61 30.99,27.18 34.04,30.23 34.04,38.1
AVCC
  Top 0.305: 40.51,27.81 U3.7
  Top 0.508: FB2.1 C34.1 R21.1 35.73,24.8 37.08,26.16 39.37,26.16 40.51,27.3 U3.7 | 32.35,22.86 FB2.1 | FB2.1 33.78,22.95 R29.2
CHRG_IN
  Top 0.254: U7.4 19.88,34.48 20.57,33.78 20.57,31.08 CHRG.2
  Top 0.508: U7.4 19.25,34.46 C2.1 15.49,34.46 R15.2
D+  (via drill 0.25)
  Top 0.203: U4.4 33.65,16.26 v35.31,16.26
  Bottom 0.203: v35.31,16.26 34.04,16.26 29.87,20.43 28.03,20.43 25.9,22.55 25.7,22.55 22.13,26.13 18.32,26.13 17.78,26.67 R31.2
D-  (via drill 0.25)
  Top 0.203: U4.3 35.19,17.13 v35.31,17.02
  Bottom 0.203: 35.31,17.27 v35.31,17.02 33.78,17.02 30.02,20.78 28.18,20.78 26.05,22.91 25.85,22.91 22.27,26.49 19.99,26.49 19.56,26.92 R30.2
GND  (via drill 0.25)
  Top 0.203: 42.67,20.07 42.57,20.17 U4.35 42.57,19.46 41.66,18.54 v36.58,18.54 36.17,18.95 U4.43 | U4.23 43.12,10.73 v42.93,10.92 | U4.15 37.77,10.34 v38.1,10.67 | U6.18 14.59,21.44 14.61,21.46 | 14.61,21.46 v14.73,21.59 | U6.8 17.62,21.94 v17.27,21.59 | U6.31 17.25,18.78 v17.27,18.8 v16,18.8 | U6.30 16.75,18.55 | U6.17 14.12,21.94 14.61,21.46 | v14.73,20.19 U6.33 16,20.32 | R1.2 11.9,14.73 v10.92,14.73 | U6.8 19.05,21.94 | 19.05,21.94 19.4,21.94 19.56,22.1 | U6.8 18.5,22.57 v19.05,23.11 | 19.05,21.94 v19.05,23.88 | C1.2 21.8,14.48 v21.34,14.48 | C9.2 v23.88,20.32 | v35.31,15.49 33.61,15.49 U4.5 33.27,15.83 32.72,15.83 32.57,15.98 32.57,16.54 32.41,16.69 v32.41,16.79 | C39.1 30.84,15.05 30.84,15.13 30.73,15.23 | 30.73,15.23 30.73,17.02 | JMP1.1 27.21,21.81 28.19,20.83 | C39.1 32.17,13.72 | 30.73,15.23 30.23,15.74 30.23,17.78 | C39.1 31.24,13.63 v31.24,12.7 | C19.2 28.74,23.29 v28.7,23.33 29.17,23.33 v29.46,23.62 | U5.2 29.46,27.69 v29.21,27.94 | v32.26,30.73 v32.26,29.72 | v31.75,29.72 31.5,29.97 v31.5,30.73 | U1.7 26.68,8.39 v26.16,7.87 | C5.2 30.14,7.87 v30.99,7.87 | 13.46,13.97 13.46,14.64 C20.2 13.59,14.12 v13.21,13.74 | U6.23 14.59,18.94 v14.73,18.8 | C14.2 16.51,14.22 v17.02,13.72
  Top 0.508: C21.2 C22.2
  Bottom 0.203: v17.27,21.59 17.26,21.58 | U6.33 v14.73,18.8 | U6.33 14.73,21.46 v14.73,21.59 v14.73,20.19 | U6.33 v16,18.8 | v19.05,23.88 19.56,23.37 v19.81,23.37 | v23.88,20.32 v23.88,19.3 | v28.7,23.33 28.24,22.86 v27.69,22.86 | 30.48,30.73 v31.5,30.73 v32.26,30.73 | v32.26,29.72 v31.75,29.72 | v17.27,21.59 v17.27,20.19 U6.33 | 17.27,21.46 v17.27,21.59 | U6.33 v16,21.59
  other vias: 16,20.19
  pour Bottom (rank 6): 48.77,38.1 0,38.1 0,37.08 6.6,30.48 9.14,27.94 9.14,1.52 10.67,0 48.77,0
  pour Top (rank 6): 10.67,0 9.14,1.52 9.14,27.94 0,37.08 0,38.1 48.77,38.1 48.77,0
MFP  (via drill 0.25)
  Top 0.203: U4.21 42.57,10.26 v42.42,10.41 | U2.MFP 18.07,6.83 v18.03,6.86
  Bottom 0.203: R8.1 v42.42,10.41 42.16,10.16 42.16,9.95 41,8.79 19.96,8.79 v18.03,6.86
MISO
  Top 0.203: 33.51,10.67 U4.11 31.94,10.73 30.23,12.45 28.45,12.45 27.69,13.21 27.69,17.78 ISP.1
  Bottom 0.203: JP2.2 11.18,27.18 12.95,27.18 13.72,26.42 13.72,25.65 13.8,25.65 14.56,24.89 15.75,24.89 15.86,24.99 21.74,24.99 25.65,21.08 25.86,21.08 26.54,20.4 ISP.1
MISO_3V3
  Top 0.203: U6.14 15.24,22.7 15.24,23.12 14.94,23.41 14.78,23.41 14.27,23.92 14.27,24.09 13.97,24.38 11.43,24.38 JP2.1
MOSI
  Top 0.203: ISP.4 30.48,14.99 30.48,12.7 31.64,11.53 U4.10
  Bottom 0.203: JP2.4 13.55,28.45 14.9,27.09 | 14.9,27.09 14.91,27.08 | 28.7,16.76 ISP.4 27.69,17.78 27.69,19.76 25.61,21.84 25.39,21.84 21.89,25.35 16.82,25.35 16.26,25.91 16.26,26.42 15.58,27.09 14.9,27.09
MOSI_3V3
  Top 0.203: U6.13 15.75,23.11 15.09,23.77 14.92,23.77 14.63,24.07 14.63,24.23 12.95,25.91 JP2.3
N$1
  Top 0.203: Y3.P$2 12.92,9.14 C7.2 14.39,7.86 U2.X1
N$2
  Top 0.203: U2.X2 13.21,6.83 Y3.P$1 12.36,5.9 C8.2
N$3
  Top 0.203: 20.89,18.94 C10.1 20.85,18.94 U6.2
N$4
  Top 0.203: C9.1 20.83,20.32 19.95,19.44 U6.3
N$5
  Top 0.203: U6.4 19.95,19.94 20.19,20.18 20.19,21.04 C12.2 21.84,22.69 21.84,24.38 21.75,24.48 Y2.P$1
N$6
  Top 0.203: U6.5 19.68,20.44 19.83,20.6 19.83,21.19 20.19,21.54 20.19,22.56 C13.2 20.99,23.55 Y2.P$2
N$7
  Top 0.508: JP1.3 25.91,3.3 27.84,1.37 28.8,1.37 30.73,3.3 R24.2
N$8
  Top 0.203: U6.9 17.75,23.24 18.15,23.64 18.15,25.24 C15.1
  Top 0.254: 17.78,22.72 U6.9
  Top 0.305: C1.1 22.46,16.87 | 22.46,16.87 22.35,16.98 22.35,17.53 22.1,17.78 19.16,17.78 U6.1 | R18.2 24.21,24.34 24.21,21.21 24.56,20.86 24.56,18.8 22.64,16.87 22.46,16.87
  Top 0.508: R18.2 23.41,26.12 22.35,27.18 18.58,27.18 C15.1
N$9  (via drill 0.25)
  Top 0.203: USB1.2 9.29,31.51 v9.3,31.5
  Bottom 0.203: v9.3,31.5 9.45,31.34 9.45,31.29 10.41,30.33 18.53,30.33 R30.1
N$10
  Top 0.203: L1.1 20.64,14.83 L2.2
N$11
  Top 0.203: L2.1 17.75,17.24 U6.32
N$12
  Top 0.203: U6.28 15.75,12.95 Y1.P3
  Top 0.508: Y1.P3 17.73,12.74 C16.1
N$13
  Top 0.203: U5.4 27.79,23.51 JMP1.2
N$14
  Top 0.203: U5.3 28.51,26.1 28.7,25.91 30.23,25.91 30.48,26.16 30.41,26.23 U5.1
  Top 0.508: R17.2 C18.1 28.41,26.92 U5.3
N$16
  Top 0.508: C3.1 21.86,35.5 U7.3 23.78,34.48 R16.2
N$17
  Top 0.508: U1.8 26.42,9.66 23.88,7.12 U1.3 | R20.2 30.68,9.87 C5.1 27.88,9.87 U1.8 | C26.1 27.26,9.66 U1.8
N$18
  Top 0.203: 13.88,11.09 13.71,11.09 | Y1.P1 14.51,11.88 14.56,11.88 15.01,12.32 15.01,13.44 15.25,13.69 U6.27
  Top 0.508: C17.1 13.71,11.09 Y1.P1
N$19
  Top 1.016: C23.2 L5.2
N$20
  Top 0.254: U6.22 12.84,19.44 11.72,18.33 L4.2
  Top 1.016: L5.1 10.45,18.76 10.88,18.33 L4.2
N$21
  Top 0.254: U6.21 11.77,19.94 L4.1
  Top 1.016: L4.1 11.64,20.07 10.67,20.07 10.41,20.32 9.87,20.32 L3.1
N$22
  Top 0.203: U6.25 14.09,17.53 12.95,17.53 11.94,16.51 R1.1
N$23
  Top 0.254: U6.20 12.83,20.44 11.77,21.5 C24.1
  Top 1.016: C24.1 11.01,21.5 10.58,21.93 L3.2
N$24
  Top 0.508: 7.87,12.19 8,12.32 U$28.FEED
  Top 1.016: C22.1 7.87,12.19 | C21.1 U$28.FEED C23.1
N$25
  Top 0.254: CHRG.1 R4.2
N$26
  Top 0.508: U7.5 19.05,32.35 R3.2
N$27
  Top 0.254: R4.1 22.61,31.84 U7.1
N$28  (via drill 0.25)
  Top 0.203: USB1.3 v8.64,31.5
  Bottom 0.203: v8.64,31.5 8.79,31.34 8.79,31.29 10.1,29.97 17.11,29.97 R31.1
N$29
  Top 0.203: C4.1 19.65,7.86 19.61,7.82 | 19.61,7.82 U2.VCC | R19.2 32.14,4.99 31.34,5.8 30.13,5.8 29.41,5.08 20.83,5.08 20.57,5.33 20.57,6.86 19.61,7.82
N$31
  Top 0.203: Q2.1 37.36,7.14 38.57,8.34 U4.16
  Top 0.508: 38.57,7.84 U4.16
N$32
  Top 0.203: Q2.3 40.36,6.88 39.37,7.87
  Top 0.508: 39.37,7.87 U4.17
N$36
  Top 0.508: U3.6 38.49,27.34 C33.1 37.51,27.14 35.69,27.14 | U3.1 38.58,32.23 37.38,31.03 C6.2 35.94,29.63 C32.1 35.69,27.14 | R21.2 35.69,27.14
RDYN  (via drill 0.25)
  Top 0.203: U4.20 41.77,10.05 v41.66,10.16 | U6.16 13.72,23.23 v13.72,23.37
  Bottom 0.203: v41.66,10.16 40.64,9.14 19.82,9.14 11.94,17.02 11.94,23.37 v13.72,23.37
REQN_3V3  (via drill 0.25)
  Top 0.203: U6.12 16.25,23.16 v15.13,24.28 | U4.1 31.86,20.44 28.07,20.44 27.95,20.57 v25.65,20.57
  Bottom 0.203: 15.43,24.28 v15.13,24.28 15.64,24.28 16,24.64 21.59,24.64 v25.65,20.57
RST  (via drill 0.25)
  Top 0.203: U4.13 36.17,10.06 v36.07,10.16 32.01,10.16 30.08,12.09 28.3,12.09 ISP.5
  Bottom 0.203: JP3.6 46.99,30.23 45.97,29.21 45.97,24.13 43.94,22.1 43.94,18.54 41.66,16.26 38.61,16.26 36.07,13.72 v36.07,10.16
RST_NRF  (via drill 0.25)
  Top 0.203: U4.8 34.37,13.13 v34.8,12.7 | U6.19 12.87,20.94 12.7,21.11 v12.7,22.35
  Bottom 0.203: v34.8,12.7 32.77,10.67 18.8,10.67 12.29,17.17 12.29,21.95 v12.7,22.35
SCK  (via drill 0.25)
  Top 0.203: U4.9 32.63,12.33 v32.26,12.7
  Bottom 0.203: 26.42,16.26 ISP.3 27.94,14.99 29.97,14.99 v32.26,12.7 31.24,13.72 31.24,18.55 29.72,20.07 27.88,20.07 25.75,22.2 25.54,22.2 21.96,25.78 16.89,25.78 16.61,26.05 16.61,26.56 15.72,27.45 15.05,27.45 14.99,27.51 JP2.6 15.27,28.45
SCK_3V3
  Top 0.203: U6.11 16.75,23.38 14.99,25.15 JP2.5
SCL  (via drill 0.25)
  Top 0.203: 40.51,32.64 U3.14 40.64,32.45 40.64,33.27 v40.89,33.53 41.91,33.53 43.43,32 43.43,24.64 47.35,20.73 47.35,10.52 44.34,7.52 44.34,7.51 v43.94,7.11 43.54,7.52 40.74,7.52 40.17,8.09 U4.18 | 40.13,9.4 40.17,9.44 U4.18 | U4.18 40.17,10.12 v39.88,10.41 | U1.6 v28.96,7.11 | U2.SCL 18.11,6.18 v18.03,6.1
  Bottom 0.203: JP8.2 38.86,35.05 40.39,33.53 v40.89,33.53 | R5.1 39.62,11.72 39.62,10.67 v39.88,10.41 | v43.94,7.11 43.03,6.2 29.87,6.2 v28.96,7.11 27.94,6.1 v18.03,6.1 18.03,5.97 17.91,5.84 17.82,5.84 17.53,5.54 17.53,5.12 17.82,4.83 19.18,4.83 JP1.1
SDA  (via drill 0.25)
  Top 0.203: U3.13 41.68,32.26 42.42,32.26 v42.67,32 43.03,31.65 43.03,24.53 46.99,20.57 46.99,10.67 44.2,7.87 43.67,7.87 | 40.97,9.32 U4.19 | 43.67,7.87 41.4,7.87 40.97,8.31 U4.19 | U4.19 40.97,10.08 v40.64,10.41 | v44.03,8.38 43.87,8.23 43.87,8.08 43.67,7.87 | U1.5 v28.95,5.84 v28.96,5.84 | U2.SDA 18.23,5.53 v18.03,5.33
  Bottom 0.203: v42.67,32 42.67,34.29 JP8.1 | R6.1 40.89,10.67 v40.64,10.41 | v44.03,8.38 44.45,7.96 44.45,6.9 43.39,5.84 v28.96,5.84 28.45,5.33 24.38,5.33 23.24,4.19 JP1.2 23.24,4.45 22.35,5.33 v18.03,5.33
TCK  (via drill 0.25)
  Top 0.203: U4.39 v39.37,21.84
  Bottom 0.203: JP3.1 44.32,35.94 43.43,35.05 43.43,29.97 42.72,29.26 42.72,25.65 39.37,22.3 v39.37,21.84 38.35,20.83 R25.1
TDI  (via drill 0.25)
  Top 0.203: U4.36 41.77,21.73 v41.66,21.84
  Bottom 0.203: R26.1 42.67,21.34 42.16,21.84 v41.66,21.84 41.66,22.99 JP3.9
TDO  (via drill 0.25)
  Top 0.203: U4.37 40.97,21.77 v40.89,21.84
  Bottom 0.203: JP3.3 45.47,32.38 45.47,30.23 44.7,29.46 43.94,29.46 43.43,28.96 43.43,25.27 40.89,22.73 v40.89,21.84 41.15,21.59 R27.1
TMS  (via drill 0.25)
  Top 0.203: U4.38 40.13,20.82 v40.13,21.84
  Bottom 0.203: JP3.5 44.45,30.48 43.08,29.11 43.08,25.41 40.13,22.47 v40.13,21.84 39.62,21.34 R7.1
UP_AVCC
  Top 0.406: U4.44 35.37,22 C37.1
  Top 0.508: R29.1 34.5,20.53 U4.44 | 35.47,22.35 C37.1 35.47,23.03 36.58,24.13 C38.2 38.52,22.86 42.93,22.86 44.7,21.08 44.7,19.81 44.28,19.39 44.25,19.39 43.69,18.82 43.69,11.94 44.2,11.43 44.3,11.53 U4.24
V_BATT
  Top 0.508: R16.1 25.96,30.59 | 25.96,30.59 J1.1 28.34,29.86 | R17.1 25.06,29.68 25.96,30.59
V_USB  (via drill 0.25)
  Top 0.203: USB1.1 9.94,31.52 v9.96,31.5
  Top 0.254: U4.7 34.58,13.93 v34.8,13.72
  Top 0.508: C31.1 R15.1 13.6,34.32 13.6,33.41 11.68,31.5 10.67,31.5 9.94,32.23 USB1.1
  Bottom 0.203: v9.96,31.5 10.77,30.68 18.85,30.68 19.43,30.1 20.16,30.1 20.57,29.69 20.57,27.18 20.91,26.84 22.42,26.84 26,23.27 26.2,23.27 28.32,21.14 30.16,21.14 33.52,17.78 35.3,17.78 36.07,17.01 36.07,14.99 v34.8,13.72
VDDA  (via drill 0.25)
  Top 0.203: U6.29 16.26,16.73 16.49,16.49 | 16.49,16.49 C14.1 17.23,16.47 v17.52,16.75 | 13.93,16.47 C20.1 | 16.49,16.49 17.04,16.49 17.27,16.26 17.27,15.49 17.78,14.99 17.82,14.99 L1.2 19.43,13.37 | 19.58,12.93 C11.1 19.19,12.79 | C20.1 14.16,17.04 14.48,17.04 14.75,17.31 U6.26 | C20.1 13.63,16.51 v14.73,16.51 | U6.24 13.21,18.44 v12.8,18.03
  Top 0.305: 19.43,13.37 C11.1 | FB1.2 25.02,18.61 23.37,16.96 23.37,14.48 22.1,13.21
  Top 0.406: C11.1 19.85,13.21 22.1,13.21
  Bottom 0.203: v14.73,16.51 14.33,16.51 v12.8,18.03
  Bottom 0.305: v17.52,16.75 17.27,16.51 v14.73,16.51

### Text on the board
tPlace: SCL | SDA | Patrick Hock | Litbit 2018 | REV -1